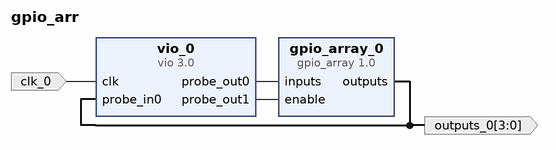
[diagram p0: block diagram of the top level]
# Vivado block design gpio_arr, xc7z010clg400-1, Vivado 2018.2
create_bd_design gpio_arr

create_bd_port -dir I -type clk clk_0
create_bd_port -dir O -from 3 -to 0 outputs_0

create_bd_cell -type ip -vlnv user.org:user:gpio_array:1.0 gpio_array_0
create_bd_cell -type ip -vlnv xilinx.com:ip:vio:3.0 vio_0
set_property -dict [list \
  CONFIG.C_PROBE_OUT1_WIDTH 4 \
  CONFIG.C_PROBE_OUT0_WIDTH 4 \
  CONFIG.C_NUM_PROBE_OUT 2 \
  CONFIG.C_EN_PROBE_IN_ACTIVITY 0 \
] [get_bd_cells vio_0]

# ---- connections ----

connect_bd_net -net clk_0_1 [get_bd_ports clk_0] [get_bd_pins vio_0/clk]
connect_bd_net [get_bd_pins vio_0/probe_out0] [get_bd_pins gpio_array_0/inputs]
connect_bd_net [get_bd_pins gpio_array_0/outputs] [get_bd_ports outputs_0] [get_bd_pins vio_0/probe_in0]
connect_bd_net [get_bd_pins vio_0/probe_out1] [get_bd_pins gpio_array_0/enable]

validate_bd_design
save_bd_design
